# EAGLE design 4x4pad (EAGLE 9.0.0)
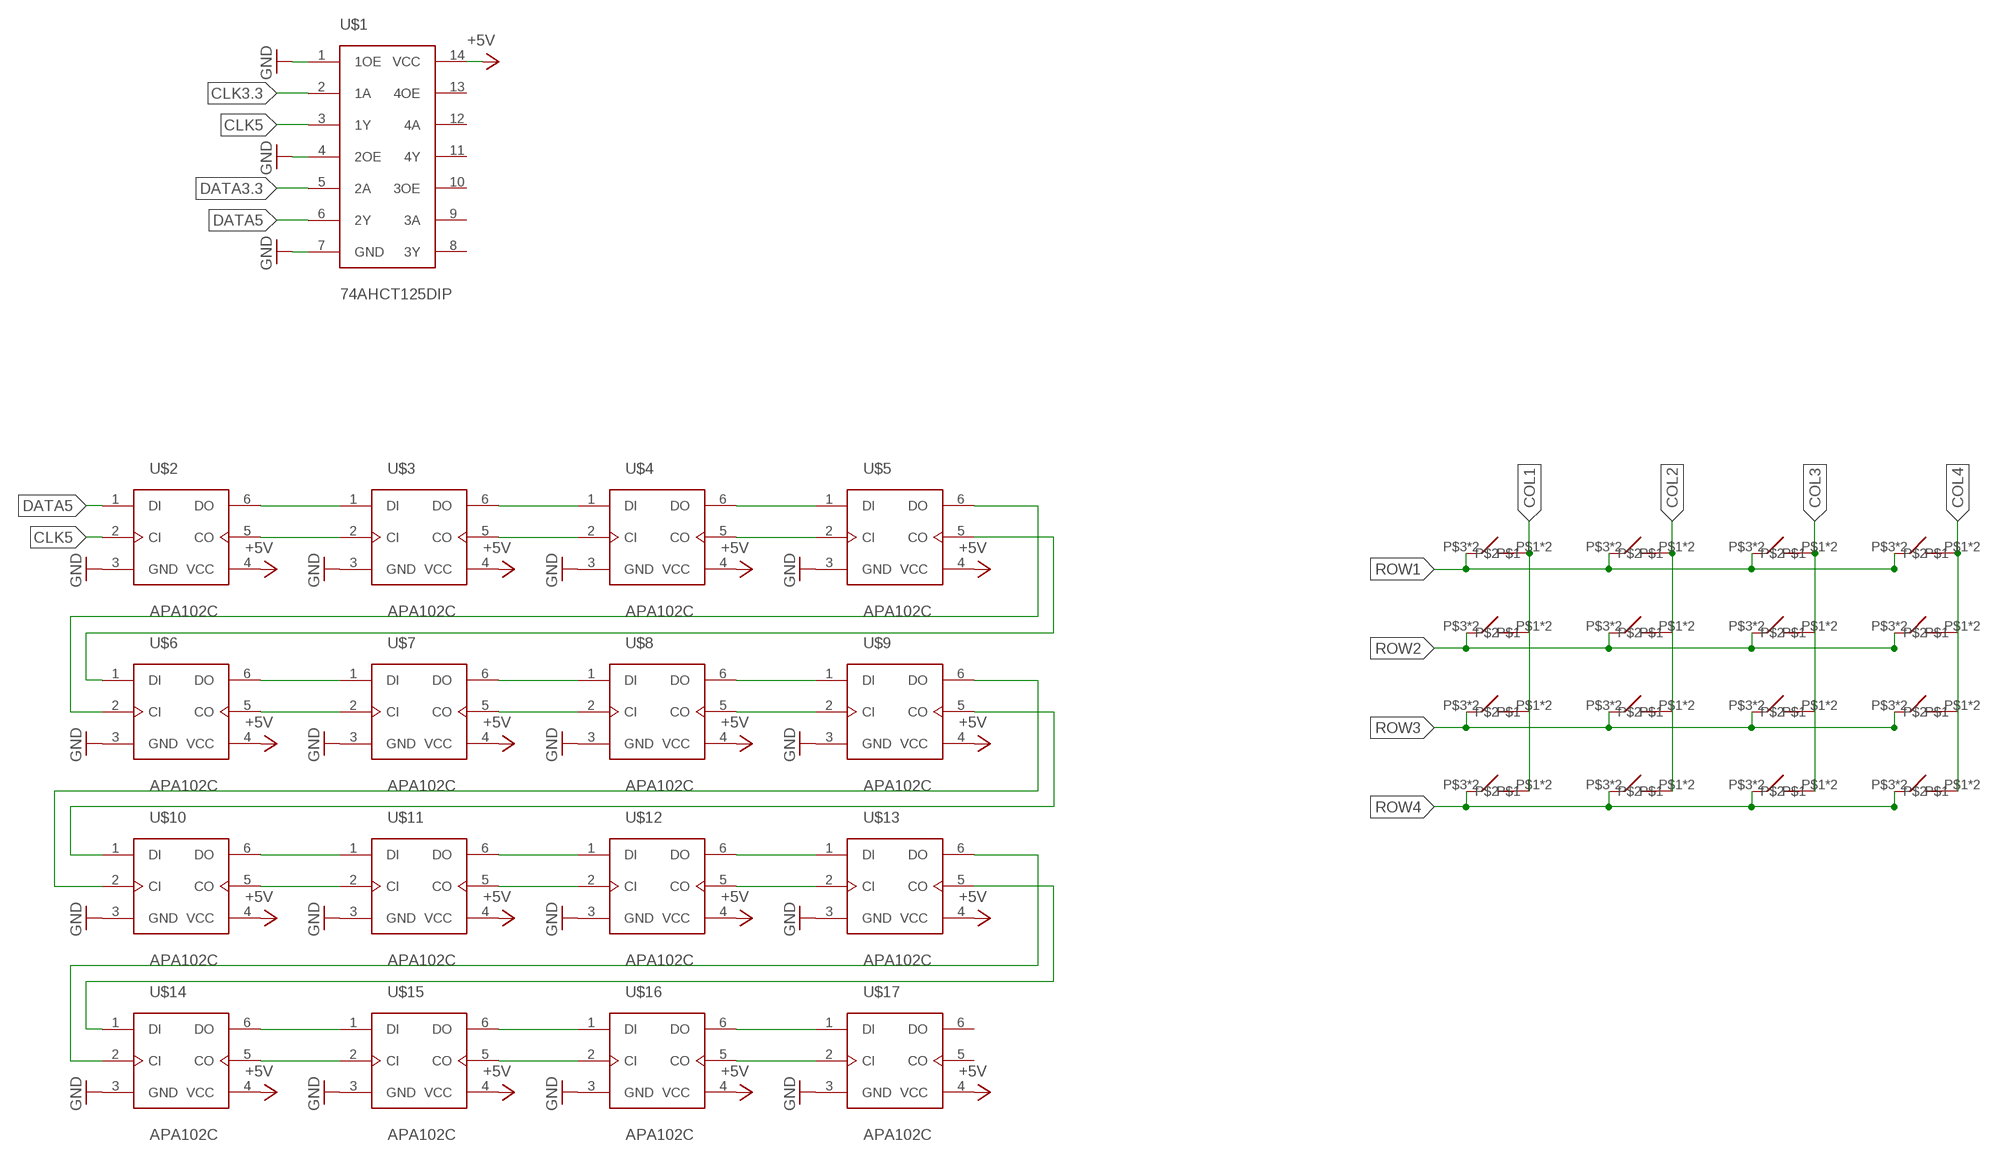
[diagram p0: schematic, sheet 1]

## Parts
U$1  74AHCT125DIP  [DIL14]
U$2  APA102C  [APA102C-5050-SMD]
U$3  APA102C  [APA102C-5050-SMD]
U$4  APA102C  [APA102C-5050-SMD]
U$5  APA102C  [APA102C-5050-SMD]
U$6  APA102C  [APA102C-5050-SMD]
U$7  APA102C  [APA102C-5050-SMD]
U$8  APA102C  [APA102C-5050-SMD]
U$9  APA102C  [APA102C-5050-SMD]
U$10  APA102C  [APA102C-5050-SMD]
U$11  APA102C  [APA102C-5050-SMD]
U$12  APA102C  [APA102C-5050-SMD]
U$13  APA102C  [APA102C-5050-SMD]
U$14  APA102C  [APA102C-5050-SMD]
U$15  APA102C  [APA102C-5050-SMD]
U$16  APA102C  [APA102C-5050-SMD]
U$17  APA102C  [APA102C-5050-SMD]
U$18  SOFT-TACTILE-PUSHBUTTON  [ADAFRUIT-SOFT-TACTILE-PUSHBUTTON]
U$19  SOFT-TACTILE-PUSHBUTTON  [ADAFRUIT-SOFT-TACTILE-PUSHBUTTON]
U$20  SOFT-TACTILE-PUSHBUTTON  [ADAFRUIT-SOFT-TACTILE-PUSHBUTTON]
U$21  SOFT-TACTILE-PUSHBUTTON  [ADAFRUIT-SOFT-TACTILE-PUSHBUTTON]
U$22  SOFT-TACTILE-PUSHBUTTON  [ADAFRUIT-SOFT-TACTILE-PUSHBUTTON]
U$23  SOFT-TACTILE-PUSHBUTTON  [ADAFRUIT-SOFT-TACTILE-PUSHBUTTON]
U$24  SOFT-TACTILE-PUSHBUTTON  [ADAFRUIT-SOFT-TACTILE-PUSHBUTTON]
U$25  SOFT-TACTILE-PUSHBUTTON  [ADAFRUIT-SOFT-TACTILE-PUSHBUTTON]
U$26  SOFT-TACTILE-PUSHBUTTON  [ADAFRUIT-SOFT-TACTILE-PUSHBUTTON]
U$27  SOFT-TACTILE-PUSHBUTTON  [ADAFRUIT-SOFT-TACTILE-PUSHBUTTON]
U$28  SOFT-TACTILE-PUSHBUTTON  [ADAFRUIT-SOFT-TACTILE-PUSHBUTTON]
U$29  SOFT-TACTILE-PUSHBUTTON  [ADAFRUIT-SOFT-TACTILE-PUSHBUTTON]
U$30  SOFT-TACTILE-PUSHBUTTON  [ADAFRUIT-SOFT-TACTILE-PUSHBUTTON]
U$31  SOFT-TACTILE-PUSHBUTTON  [ADAFRUIT-SOFT-TACTILE-PUSHBUTTON]
U$32  SOFT-TACTILE-PUSHBUTTON  [ADAFRUIT-SOFT-TACTILE-PUSHBUTTON]
U$33  SOFT-TACTILE-PUSHBUTTON  [ADAFRUIT-SOFT-TACTILE-PUSHBUTTON]

## Nets
CLK3.3: U$1.2(1A)
CLK5: U$1.3(1Y) U$2.2(CI)
COL1: U$18.P$1 U$18.P$2 U$30.P$1 U$30.P$2
COL2: U$19.P$1 U$19.P$2 U$31.P$1 U$31.P$2
COL3: U$20.P$1 U$20.P$2 U$32.P$1 U$32.P$2
COL4: U$21.P$1 U$21.P$2 U$33.P$1 U$33.P$2
DATA3.3: U$1.5(2A)
DATA5: U$1.6(2Y) U$2.1(DI)
N$1: U$2.6(DO) U$3.1(DI)
N$2: U$2.5(CO) U$3.2(CI)
N$3: U$3.5(CO) U$4.2(CI)
N$4: U$3.6(DO) U$4.1(DI)
N$5: U$4.6(DO) U$5.1(DI)
N$6: U$4.5(CO) U$5.2(CI)
N$7: U$6.6(DO) U$7.1(DI)
N$8: U$6.5(CO) U$7.2(CI)
N$9: U$7.5(CO) U$8.2(CI)
N$10: U$7.6(DO) U$8.1(DI)
N$11: U$8.6(DO) U$9.1(DI)
N$12: U$8.5(CO) U$9.2(CI)
N$13: U$5.5(CO) U$6.1(DI)
N$14: U$5.6(DO) U$6.2(CI)
N$15: U$10.6(DO) U$11.1(DI)
N$16: U$10.5(CO) U$11.2(CI)
N$17: U$11.5(CO) U$12.2(CI)
N$18: U$11.6(DO) U$12.1(DI)
N$19: U$12.6(DO) U$13.1(DI)
N$20: U$12.5(CO) U$13.2(CI)
N$21: U$14.6(DO) U$15.1(DI)
N$22: U$14.5(CO) U$15.2(CI)
N$23: U$15.5(CO) U$16.2(CI)
N$24: U$15.6(DO) U$16.1(DI)
N$25: U$16.6(DO) U$17.1(DI)
N$26: U$16.5(CO) U$17.2(CI)
N$27: U$13.5(CO) U$14.1(DI)
N$28: U$13.6(DO) U$14.2(CI)
N$29: U$9.5(CO) U$10.1(DI)
N$30: U$9.6(DO) U$10.2(CI)
N$36: U$1.14(VCC) U$2.4(VCC) U$3.4(VCC) U$4.4(VCC) U$5.4(VCC) U$6.4(VCC) U$7.4(VCC) U$8.4(VCC) U$9.4(VCC) U$10.4(VCC) U$11.4(VCC) U$12.4(VCC) U$13.4(VCC) U$14.4(VCC) U$15.4(VCC) U$16.4(VCC) U$17.4(VCC) ; supply symbol labelled +5V
N$37: U$1.1(1OE) U$1.4(2OE) U$1.7(GND) U$2.3(GND) U$3.3(GND) U$4.3(GND) U$5.3(GND) U$6.3(GND) U$7.3(GND) U$8.3(GND) U$9.3(GND) U$11.3(GND) U$12.3(GND) U$13.3(GND) U$15.3(GND) U$16.3(GND) U$17.3(GND) ; supply symbol labelled GND
ROW1: U$18.P$3 U$18.P$4 U$19.P$3 U$19.P$4 U$20.P$3 U$20.P$4 U$21.P$3 U$21.P$4
ROW2: U$22.P$3 U$22.P$4 U$23.P$3 U$23.P$4 U$24.P$3 U$24.P$4 U$25.P$3 U$25.P$4
ROW3: U$26.P$3 U$26.P$4 U$27.P$3 U$27.P$4 U$28.P$3 U$28.P$4 U$29.P$3 U$29.P$4
ROW4: U$30.P$3 U$30.P$4 U$31.P$3 U$31.P$4 U$32.P$3 U$32.P$4 U$33.P$3 U$33.P$4
Unconnected: U$1.8(3Y) U$1.9(3A) U$1.10(3OE) U$1.11(4Y) U$1.12(4A) U$1.13(4OE) U$17.5(CO) U$17.6(DO) U$22.P$1 U$22.P$2 U$23.P$1 U$23.P$2 U$24.P$1 U$24.P$2 U$25.P$1 U$25.P$2 U$26.P$1 U$26.P$2 U$27.P$1 U$27.P$2 U$28.P$1 U$28.P$2 U$29.P$1 U$29.P$2

## Power pins joined to a net without a drawn wire
N$37: U$10.3(GND) U$14.3(GND)

## Library data of the parts
U$1 = launchpadParts:74AHCT125: 74AHCT125 Quad Level Shifter Data Sheet: https://cdn-shop.adafruit.com/product-files/1787/1787AHC125.pdf
U$2-U$17 = launchpadParts:APA102C: APA201C RGB LED using the SPI interface. 5050 SMD package Sold by Adafruit as Dotstars Resources: Datasheet <https://cdn-shop.adafruit.com/datasheets/APA102.pdf>
U$18-U$33 = launchpadParts:SOFT-TACTILE-PUSHBUTTON: Soft Tactile Button Pushbutton from Adafruit

## Board
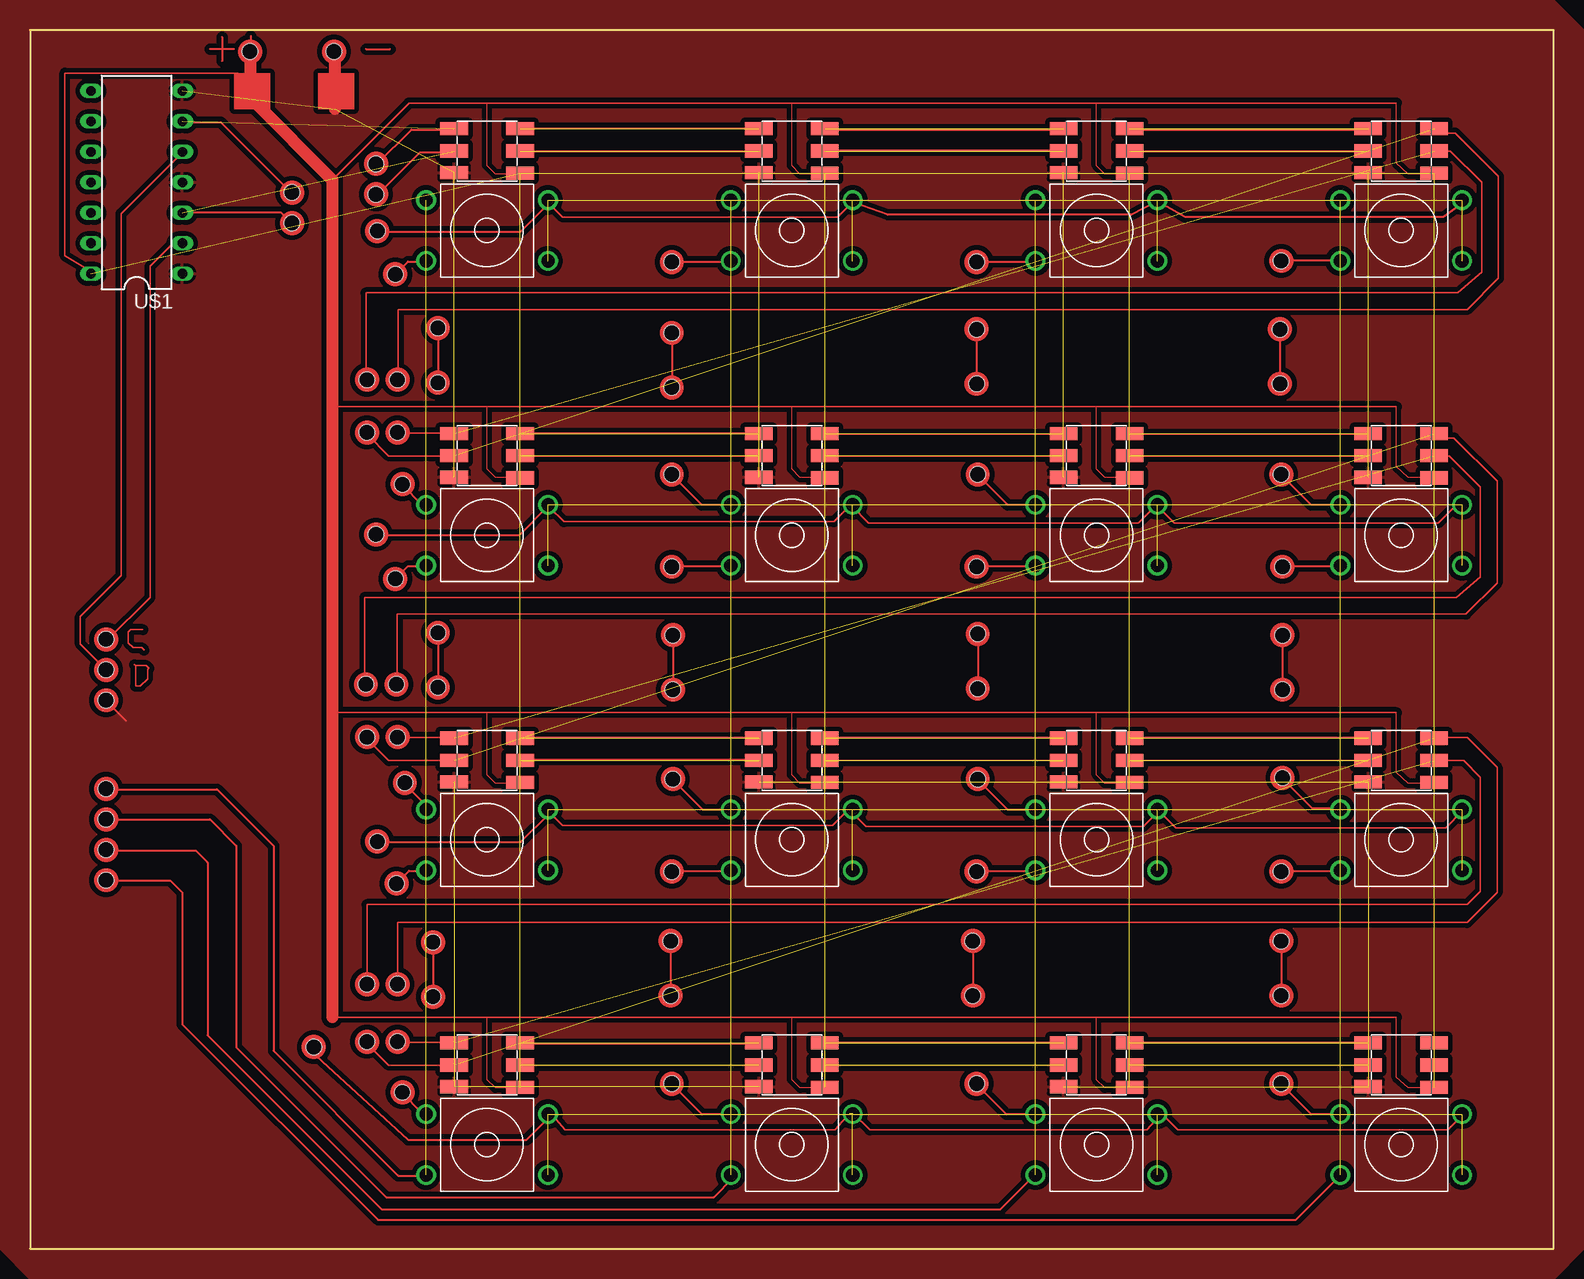
[diagram p1: board, top side]

Size 127 x 101.6 mm. Coordinates in mm from the lower left corner, seen from the top.
Outline: 0,101.6 0,0 127,0 127,101.6 0,101.6
Copper layers (1*16): Top 0.035mm / dielectric 1.5mm / Bottom 0.035mm
Design rules "OthermillDRC_1_64_v2": minimum track width 16mil, minimum drill 31mil, track to track 0.39878125mm, track to pad 0.39878125mm, pad to pad 0.39878125mm, via to via 0.39878125mm, smd to smd 0mil, copper to edge 0mil, drill to drill 1mil, minimum pad ring 0mil, minimum via ring 15mil, stop-mask expansion 1mil, vias tented up to drill 30mil, thermal gap 10mil
Holes 1.27 mm at 6.35,50.8 18.35,99.8 25.35,99.8 6.35,48.26 6.35,45.72 28.1,68.05 30.64,68.05 28.1,72.45 30.64,72.45 28.1,22.05 30.64,22.05 104.3,82.35 78.9,82.25 53.5,82.25 104.4,56.85 78.9,56.85 53.5,56.85 53.5,31.45 78.9,31.45 104.3,31.45 53.5,64.55 79,64.55 104.3,64.55 53.6,39.15 79,39.15 104.4,39.25 104.3,13.75 78.9,13.75 53.5,13.75 28.1,42.65 30.64,42.65 28,47.05 30.54,47.05 28.1,17.25 30.64,17.25 53.5,76.35 53.5,71.8 78.9,76.65 78.9,72.1 104.2,76.65 104.2,72.1 53.6,51.15 53.6,46.6 79,51.25 79,46.7 104.4,51.15 104.4,46.6 104.3,25.65 104.3,21.1 78.6,25.65 78.6,21.1 53.4,25.65 53.4,21.1 6.35,38.34 6.35,35.8 6.35,33.26 6.35,30.72 28.95,84.84 28.85,59.54 28.95,33.94 23.65,16.82 30.45,81.24 30.45,55.84 30.55,30.44 31.05,63.74 31.25,38.84 31.05,13.04 34,76.75 34,72.2 34,51.35 34,46.8 33.6,25.55 33.6,21 21.85,88.04 21.85,85.5 28.85,90.44 28.85,87.9

### Footprints (pad centres in the part's own frame; a part is rotated, then mirrored left to right if it is on the bottom)
DIL14 = drill 0.813 long: 1 -7.62,-3.81; 2 -5.08,-3.81; 3 -2.54,-3.81; 4 0,-3.81; 5 2.54,-3.81; 6 5.08,-3.81; 7 7.62,-3.81; 8 7.62,3.81; 9 5.08,3.81; 10 2.54,3.81; 11 0,3.81; 12 -2.54,3.81; 13 -5.08,3.81; 14 -7.62,3.81
APA102C-5050-SMD = smd 2.3 x 1.1: 1 -2.75,1.85; 2 -2.75,0; 3 -2.75,-1.8; 4 2.75,-1.85; 5 2.75,0; 6 2.75,1.85
ADAFRUIT-SOFT-TACTILE-PUSHBUTTON = drill 1.1: P$1 -5.08,2.54; P$2 -5.08,-2.54; P$3 5.08,-2.54; P$4 5.08,2.54

### Placement (x,y rotation side)
U$1  8.89,88.9 90 top
U$2  38.1,91.52 0 top
U$3  63.5,91.52 0 top
U$4  88.9,91.52 0 top
U$5  114.3,91.52 0 top
U$6  38.1,66.12 0 top
U$7  63.5,66.12 0 top
U$8  88.9,66.12 0 top
U$9  114.3,66.12 0 top
U$10  38.1,40.72 0 top
U$11  63.5,40.72 0 top
U$12  88.9,40.72 0 top
U$13  114.3,40.72 0 top
U$14  38.1,15.32 0 top
U$15  63.5,15.32 0 top
U$16  88.9,15.32 0 top
U$17  114.3,15.32 0 top
U$18  38.1,84.88 0 top
U$19  63.5,84.88 0 top
U$20  88.9,84.88 0 top
U$21  114.3,84.88 0 top
U$22  38.1,59.48 0 top
U$23  63.5,59.48 0 top
U$24  88.9,59.48 0 top
U$25  114.3,59.48 0 top
U$26  38.1,34.08 0 top
U$27  63.5,34.08 0 top
U$28  88.9,34.08 0 top
U$29  114.3,34.08 0 top
U$30  38.1,8.68 0 top
U$31  63.5,8.68 0 top
U$32  88.9,8.68 0 top
U$33  114.3,8.68 0 top

### Tracks (layer width: path | path; a pad name or v marks a point on that pad's centre or on a via)
CLK5  (1 unrouted)
COL1  (3 unrouted)
COL2  (3 unrouted)
COL3  (3 unrouted)
COL4  (3 unrouted)
DATA5  (1 unrouted)
N$1  (1 unrouted)
N$2  (1 unrouted)
N$3  (1 unrouted)
N$4  (1 unrouted)
N$5  (1 unrouted)
N$6  (1 unrouted)
N$7  (1 unrouted)
N$8  (1 unrouted)
N$9  (1 unrouted)
N$10  (1 unrouted)
N$11  (1 unrouted)
N$12  (1 unrouted)
N$13  (1 unrouted)
N$14  (1 unrouted)
N$15  (1 unrouted)
N$16  (1 unrouted)
N$17  (1 unrouted)
N$18  (1 unrouted)
N$19  (1 unrouted)
N$20  (1 unrouted)
N$21  (1 unrouted)
N$22  (1 unrouted)
N$23  (1 unrouted)
N$24  (1 unrouted)
N$25  (1 unrouted)
N$26  (1 unrouted)
N$27  (1 unrouted)
N$28  (1 unrouted)
N$29  (1 unrouted)
N$30  (1 unrouted)
N$31
  Top 0.05: 117,89.6 114.9,89.6 113.9,90.5 113.9,95.5
  Top 0.125: 113.9,95.5 31.6,95.5 25.2,89.1
  Top 1: 18.6,95.7 25.2,89.1 25.2,19.3
N$32
  Top 1: 18.4,96.3 18.4,99.8
N$33
  Top 0.152: 16,101 16,99
N$34
  Top 0.152: 17,100 15,100
N$35
  Top 0.152: 28,100 30,100
N$36  (16 unrouted)
N$37  (12 unrouted)
  Top 0.152: 6.9,45.1 8,44
  Top 1: 25.4,99 25.4,95
  pour Top: -2.54,104.14 -2.54,0 0,-2.54 127,-2.54 129.54,0 129.54,101.6 127,104.14
  pour Top: 24,98 24,95 27,95 27,98
N$39
  Top 0.05: 91.7,89.6 89.6,89.6 88.9,90.3 88.9,95.5
N$40
  Top 0.05: 117,38.8 114.9,38.8 113.9,39.7 113.9,44.7
  Top 0.125: 113.9,44.7 25.4,44.7
N$41
  Top 0.152: 18.4,101.1 18.4,100
N$42
  Top 0.152: 40.8,91.5 60.96,91.5 60.96,91.44
N$43
  Top 0.152: 40.8,93.4 60.7,93.4 60.7,93.3
N$44
  Top 0.152: 66.3,93.3 86.1,93.3
N$45
  Top 0.152: 91.6,93.3 111.6,93.3
N$46
  Top 0.152: 66.3,91.6 86.2,91.6 86.2,91.4
N$47
  Top 0.152: 91.9,91.5 111.6,91.5 111.6,91.4
N$48
  Top 0.125: 40.9,68 60.7,68
N$49
  Top 0.152: 104.3,31.5 109.2,31.5
N$50
  Top 0.152: 104.4,56.9 109.3,56.9
N$51
  Top 0.152: 119.6,87.3 117.8,86 96.3,86 94.2,87.2 94.1,87.2
N$52
  Top 0.152: 93.9,87.3 91.8,86.2 71.5,86.2 68.7,87.2 68.7,87.5
N$53
  Top 0.125: 5.2,81.4 2.9,82.8 2.9,98 17.3,98 17.6,97.7
N$54
  Top 0.05: 66.3,89.6 64.2,89.6 63.5,90.3 63.5,95.5
N$55
  Top 0.05: 40.9,89.6 38.8,89.6 38.1,90.3 38.1,95.5
N$56
  Top 0.05: 117,64.3 114.9,64.3 113.9,65.2 113.9,70.2
  Top 0.125: 113.9,70.2 25.2,70.2
N$57
  Top 0.05: 91.7,38.8 89.6,38.8 88.9,39.5 88.9,44.7
N$58
  Top 0.05: 91.7,64.3 89.6,64.3 88.9,65 88.9,70.2
N$59
  Top 0.125: 66.3,67.9 86.1,67.9
N$60
  Top 0.125: 91.7,67.9 111.3,67.9 111.4,67.8
N$61
  Top 0.05: 66.3,64.3 64.2,64.3 63.5,65 63.5,70.2
N$62
  Top 0.125: 40.9,66.1 60.6,66.1
N$63
  Top 0.152: 6.3,33.2 13.8,33.2 14.8,32.2 14.8,17.8 29.3,3.3 80.9,3.3 83.8,6.2
N$64
  Top 0.125: 66.3,66.1 86.1,66.1
N$65
  Top 0.125: 91.7,66.1 111.4,66.1
N$66
  Top 0.125: 40.8,42.6 60.7,42.6
N$67
  Top 0.125: 66.3,42.6 86,42.6
N$68
  Top 0.125: 91.7,42.6 111.6,42.6
N$69
  Top 0.125: 40.9,40.8 60.6,40.8
N$70
  Top 0.125: 66.2,40.7 86.1,40.7
N$71
  Top 0.125: 91.7,40.7 111.5,40.7
N$72
  Top 0.125: 40.8,17.1 60.6,17.1
N$73
  Top 0.125: 66.3,17.2 86.1,17.2
N$74
  Top 0.125: 91.7,17.2 111.5,17.2
N$75
  Top 0.125: 40.9,15.3 60.6,15.3
N$76
  Top 0.125: 66.3,15.3 86.1,15.3
N$77
  Top 0.125: 91.7,15.3 111.4,15.3 111.5,15.2
N$78
  Top 0.125: 9.4,51.6 8.4,51.6 8.2,51.4 8.2,50.5 8.6,50.1 9.3,50.1 9.5,49.9
N$79
  Top 0.125: 8.7,48.7 8.8,48.6 8.8,46.9 9.2,46.9 9.8,47.5 9.8,48.3 9.9,48.4 9.7,48.6 8.9,48.6
N$80
  Top 0.125: 6.3,48.3 4.2,50.4 4.2,52.7 7.6,56.1 7.6,86.3 12.6,91.3
N$81
  Top 0.125: 6.4,50.7 10,54.3 10,81.9 11.9,83.8 12.3,83.8
N$82
  Top 0.125: 68.6,87.3 67.3,86 44.4,86 43.3,87.1
N$83
  Top 0.05: 40.9,64.3 38.8,64.3 38.1,65 38.1,70.2
N$84
  Top 0.05: 66.3,38.8 64.2,38.8 63.5,39.5 63.5,44.7
N$85
  Top 0.05: 40.9,38.8 38.8,38.8 38.1,39.5 38.1,44.7
N$86
  Top 0.05: 117,13.4 114.9,13.4 113.9,14.3 113.9,19.3
  Top 0.125: 113.9,19.3 25.2,19.3
N$87
  Top 0.05: 91.7,13.4 89.6,13.4 88.9,14.1 88.9,19.3
N$88
  Top 0.05: 66.3,13.4 64.2,13.4 63.5,14.1 63.5,19.3
N$89
  Top 0.05: 40.9,13.4 38.8,13.4 38.1,14.1 38.1,19.3
N$90
  Top 0.125: 35.4,68 30.7,68
N$91
  Top 0.125: 35.4,66.1 29.9,66.1 28.1,67.9
N$92
  Top 0.152: 104.3,82.4 109.2,82.4
N$93
  Top 0.125: 117.8,91.5 118.4,91.5 121,88.9 121,81.4 119,79.7 28,79.7 28,72.3
N$94
  Top 0.125: 117.4,93 118.8,93 122.4,89.4 122.4,80.9 119.8,78.3 30.7,78.3 30.7,72.3
N$95
  Top 0.125: 118.9,62 117.4,60.5 95.4,60.5 94.2,61.7
N$96
  Top 0.125: 93.9,62 92.4,60.5 69.9,60.5 68.5,61.9 68.3,61.9 67,60.6 44.5,60.6 43.3,61.8
N$97
  Top 0.125: 119.4,36.5 118,35.1 95.5,35.1 94.1,36.5 92.8,35.2 69.7,35.2 68.4,36.5 68.1,36.5 66.9,35.3 44.4,35.3 43.4,36.3 43.3,36.3
N$98
  Top 0.125: 35.4,42.6 30.7,42.6
N$99
  Top 0.125: 35.4,40.7 29.9,40.7 28.1,42.5
N$100
  Top 0.125: 35.4,17.2 30.7,17.2
N$101
  Top 0.125: 35.4,15.3 29.9,15.3 28.1,17.1
N$102
  Top 0.125: 117.7,66.1 118.3,66.1 120.9,63.5 120.9,56 118.9,54.3 27.9,54.3 27.9,46.9
N$103
  Top 0.125: 117.3,67.6 118.7,67.6 122.3,64 122.3,55.5 119.7,52.9 30.6,52.9 30.6,46.9
N$104
  Top 0.125: 117.1,40.7 119.5,40.7 120.9,39.3 120.9,29.8 119.8,28.7 28.1,28.7 28.1,22
N$105
  Top 0.125: 117.1,42.6 119.8,42.6 122.3,40.1 122.3,29.7 119.8,27.2 30.64,27.2 30.64,22
N$106
  Top 0.152: 78.9,82.3 83.8,82.3
N$107
  Top 0.152: 53.5,82.3 58.4,82.3
N$108
  Top 0.152: 78.9,56.9 83.8,56.9
N$109
  Top 0.152: 53.5,56.9 58.4,56.9
N$110
  Top 0.152: 53.5,31.5 58.4,31.5
N$111
  Top 0.152: 78.9,31.5 83.8,31.5
N$112
  Top 0.152: 58.4,62 56,62 53.5,64.5
N$113
  Top 0.152: 83.9,62 81.5,62 79,64.5
N$114
  Top 0.152: 109.2,62 106.8,62 104.3,64.5
N$115
  Top 0.152: 58.5,36.6 56.1,36.6 53.6,39.1
N$116
  Top 0.152: 83.9,36.6 81.5,36.6 79,39.1
N$117
  Top 0.152: 109.3,36.7 106.9,36.7 104.4,39.2
N$118
  Top 0.152: 109.2,11.2 106.8,11.2 104.3,13.7
N$119
  Top 0.152: 83.8,11.2 81.4,11.2 78.9,13.7
N$120
  Top 0.152: 58.4,11.2 56,11.2 53.5,13.7
N$121
  Top 0.152: 53.5,76.4 53.5,72.2
N$122
  Top 0.152: 78.9,76.7 78.9,72.5
N$123
  Top 0.152: 104.2,76.7 104.2,72.5
N$124
  Top 0.152: 53.6,51.2 53.6,47
N$125
  Top 0.152: 79,51.3 79,47.1
N$126
  Top 0.152: 104.4,51.2 104.4,47
N$127
  Top 0.152: 104.3,25.7 104.3,21.5
N$128
  Top 0.152: 78.6,25.7 78.6,21.5
N$129
  Top 0.152: 53.4,25.7 53.4,21.5
N$130  (1 unrouted)
  Top 0.125: 119.6,11.3 118.2,9.9 95.7,9.9 94.3,11.3 93.1,9.9 70,9.9 68.6,11.3 | 68.3,11.3 67.1,9.9 44.6,9.9 43.6,11.1
N$131
  Top 0.152: 6.4,38.3 15.6,38.3 20.3,33.6 20.3,16.5 30.7,6.1 33.1,6.1
N$132
  Top 0.152: 6.4,35.8 15,35.8 17.2,33.6 17.2,16.8 29.7,4.3 57,4.3 58.6,5.9
N$133
  Top 0.152: 6.2,30.7 11.7,30.7 12.7,29.7 12.7,18.7 29,2.4 105.5,2.4 109.3,6.2
N$134
  Top 0.152: 29,84.8 40.9,84.8 43.3,87.2
N$135
  Top 0.152: 28.9,59.5 40.8,59.5 43.2,61.9
N$136
  Top 0.152: 29,33.9 40.9,33.9 43.3,36.3
N$137
  Top 0.152: 23.4,16.5 31.5,9.1 41.4,9.1 43.3,11 43.3,11.1
N$138
  Top 0.152: 30.4,81.2 31.5,82.3 33,82.3
N$139
  Top 0.152: 30.4,55.8 31.5,56.9 33,56.9
N$140
  Top 0.152: 30.5,30.4 31.6,31.5 33.1,31.5
N$141
  Top 0.152: 31,63.7 32.7,62 33.1,62
N$142
  Top 0.152: 31.2,38.8 32.9,37.1
N$143
  Top 0.152: 31,13 32.7,11.3
N$144
  Top 0.152: 34,76.8 34,72.6
N$145
  Top 0.152: 34,51.4 34,47.2
N$146
  Top 0.152: 33.6,25.6 33.6,21.4
N$147
  Top 0.152: 28.9,90.4 31.8,93.3 35.3,93.3
N$148
  Top 0.152: 29,87.9 32.5,91.4 35.4,91.4
N$149
  Top 0.152: 12.7,93.9 15.9,93.9 21.8,88
ROW1  (7 unrouted)
ROW2  (7 unrouted)
ROW3  (7 unrouted)
ROW4  (7 unrouted)
S$1
  Top 0.152: 12.7,86.4 20.9,86.4 21.7,85.6
VCC
  pour Top: 17,98 17,95 20,95 20,98
(copper drawn outside any net)
  shapes: Top area x2, Top circle x77